# Altium schematic sheet SH7 - RAIL MONITORING.SchDoc: Power Distribution Board Rev2 - Voltage Sensing
size Letter; DrawnBy: Cindy Li; Organization: Altium Limited; Address1: L3, 12a Rodborough Rd; Address2: Frenchs Forest; Address3: NSW; Address4: Australia 2086; SheetNumber: 7; SheetTotal: 10
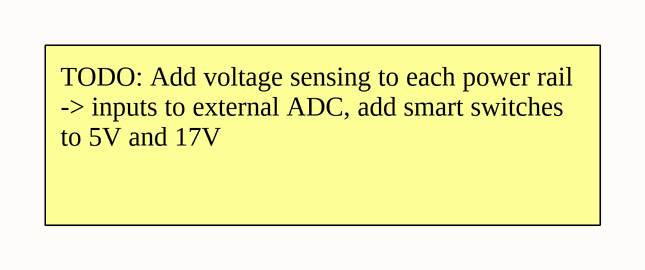
[diagram p0: SH7 - RAIL MONITORING.SchDoc]

## Notes on the sheet
- TODO: Add voltage sensing to each power rail -> inputs to external ADC, add smart switches to 5V and 17V
- Title
- Size:
- Date:
- Letter
- Drawn By:
- Sheet
- of
- File: